# Altium schematic sheet 7_DDR3L.SchDoc: DDR3L Configuration
size Letter; Date: 12/28/2025; Author: Praveen Perera; DrawnBy: Praveen Perera; Engineer: Praveen Perera; Revision: 0; SheetNumber: 7; SheetTotal: 8
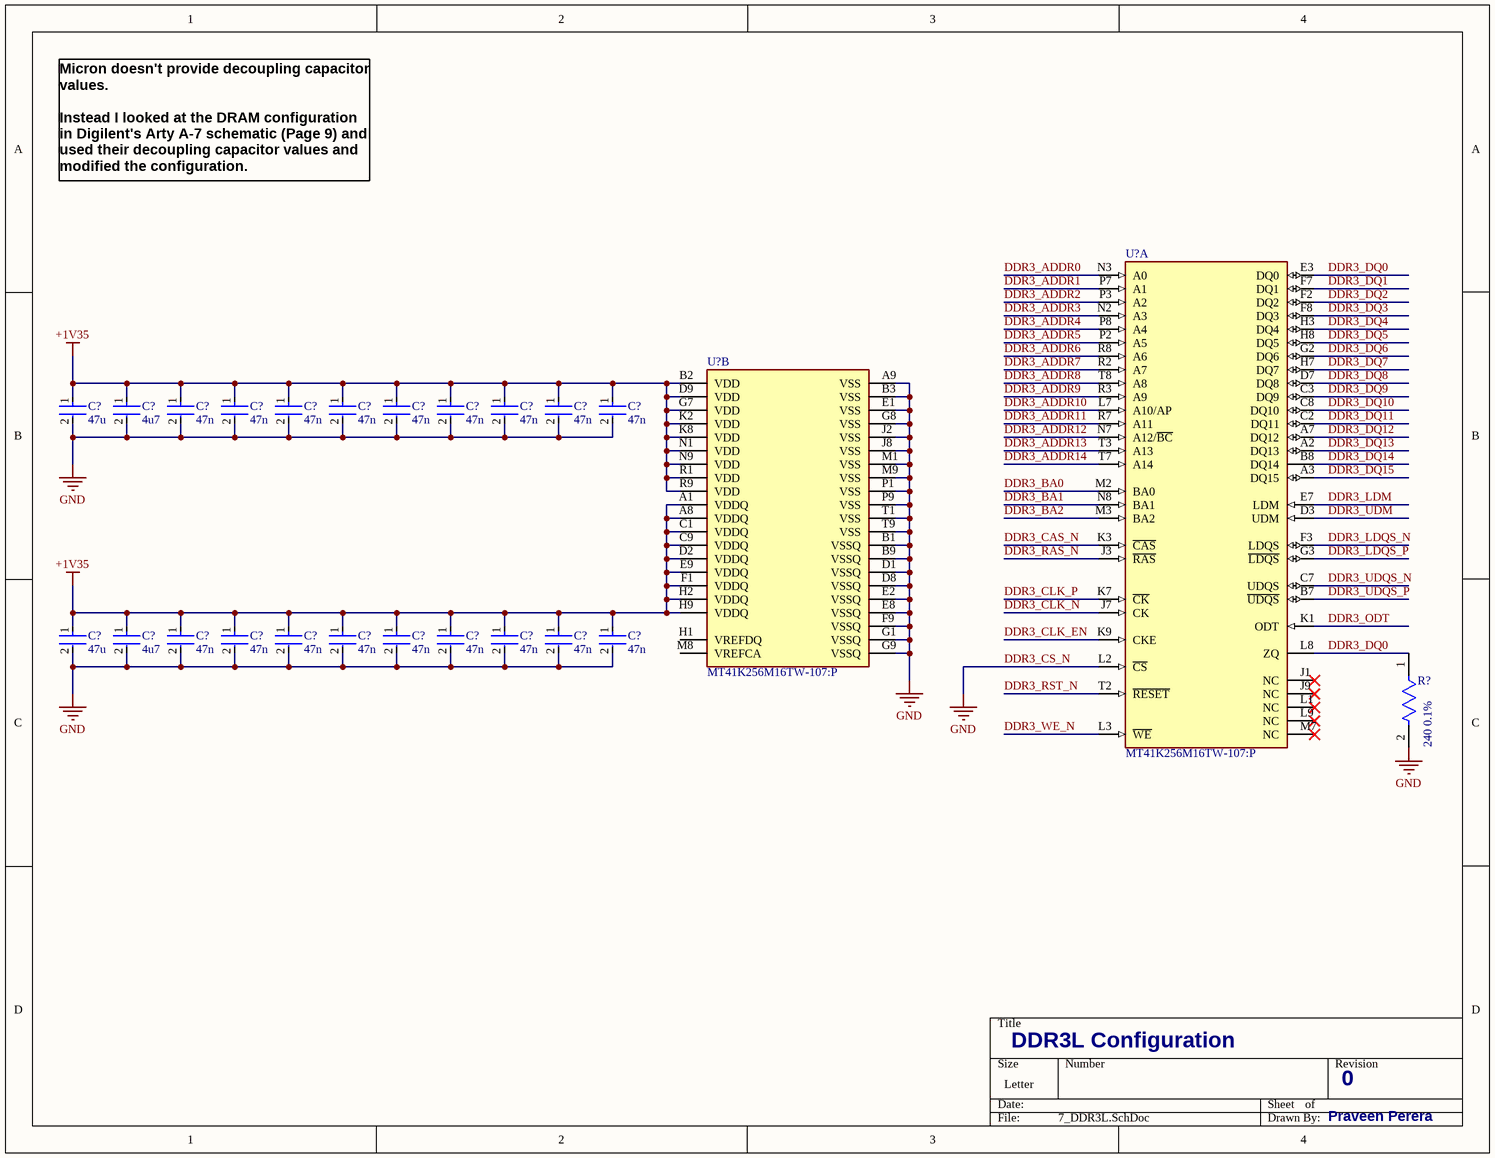
[diagram p0: 7_DDR3L.SchDoc]

## Parts
(Parts that share a designator on the sheet are numbered #1, #2 ... from top to bottom, then left to right.)
C?#1  47u  [FP-GRM188-0_2-IPC_B]
C?#2  4u7  [FP-CL829-IPC_C]
C?#3  47n  [FP-C0603-030-0_03-IPC_A]
C?#4  47n  [FP-C0603-030-0_03-IPC_A]
C?#5  47n  [FP-C0603-030-0_03-IPC_A]
C?#6  47n  [FP-C0603-030-0_03-IPC_A]
C?#7  47n  [FP-C0603-030-0_03-IPC_A]
C?#8  47n  [FP-C0603-030-0_03-IPC_A]
C?#9  47n  [FP-C0603-030-0_03-IPC_A]
C?#10  47n  [FP-C0603-030-0_03-IPC_A]
C?#11  47n  [FP-C0603-030-0_03-IPC_A]
C?#12  47u  [FP-GRM188-0_2-IPC_B]
C?#13  4u7  [FP-CL829-IPC_C]
C?#14  47n  [FP-C0603-030-0_03-IPC_A]
C?#15  47n  [FP-C0603-030-0_03-IPC_A]
C?#16  47n  [FP-C0603-030-0_03-IPC_A]
C?#17  47n  [FP-C0603-030-0_03-IPC_A]
C?#18  47n  [FP-C0603-030-0_03-IPC_A]
C?#19  47n  [FP-C0603-030-0_03-IPC_A]
C?#20  47n  [FP-C0603-030-0_03-IPC_A]
C?#21  47n  [FP-C0603-030-0_03-IPC_A]
C?#22  47n  [FP-C0603-030-0_03-IPC_A]
R?  240 0.1%  [FP-RT0201-MFG]
U?#1  MT41K256M16TW-107:P  [FP-TW-IPC_C]  (part A of 2)
U?#2  MT41K256M16TW-107:P  [FP-TW-IPC_C]  (part B of 2)

## Nets
+1V35: C?#1.1 C?#2.1 C?#3.1 C?#4.1 C?#5.1 C?#6.1 C?#7.1 C?#8.1 C?#9.1 C?#10.1 C?#11.1 C?#12.1 C?#13.1 C?#14.1 C?#15.1 C?#16.1 C?#17.1 C?#18.1 C?#19.1 C?#20.1 C?#21.1 C?#22.1 U?#2.A1(VDDQ) U?#2.A8(VDDQ) U?#2.B2(VDD) U?#2.C1(VDDQ) U?#2.C9(VDDQ) U?#2.D2(VDDQ) U?#2.D9(VDD) U?#2.E9(VDDQ) U?#2.F1(VDDQ) U?#2.G7(VDD) U?#2.H2(VDDQ) U?#2.H9(VDDQ) U?#2.K2(VDD) U?#2.K8(VDD) U?#2.N1(VDD) U?#2.N9(VDD) U?#2.R1(VDD) U?#2.R9(VDD)
DDR3_CS_N: C?#1.2 C?#2.2 C?#3.2 C?#4.2 C?#5.2 C?#6.2 C?#7.2 C?#8.2 C?#9.2 C?#10.2 C?#11.2 C?#12.2 C?#13.2 C?#14.2 C?#15.2 C?#16.2 C?#17.2 C?#18.2 C?#19.2 C?#20.2 C?#21.2 C?#22.2 R?.2 U?#1.L2(~{CS}) U?#2.A9(VSS) U?#2.B1(VSSQ) U?#2.B3(VSS) U?#2.B9(VSSQ) U?#2.D1(VSSQ) U?#2.D8(VSSQ) U?#2.E1(VSS) U?#2.E2(VSSQ) U?#2.E8(VSSQ) U?#2.F9(VSSQ) U?#2.G1(VSSQ) U?#2.G8(VSS) U?#2.G9(VSSQ) U?#2.J2(VSS) U?#2.J8(VSS) U?#2.M1(VSS) U?#2.M9(VSS) U?#2.P1(VSS) U?#2.P9(VSS) U?#2.T1(VSS) U?#2.T9(VSS)  [also labelled GND]
DDR3_ADDR0: U?#1.N3(A0)
DDR3_ADDR1: U?#1.P7(A1)
DDR3_ADDR2: U?#1.P3(A2)
DDR3_ADDR3: U?#1.N2(A3)
DDR3_ADDR4: U?#1.P8(A4)
DDR3_ADDR5: U?#1.P2(A5)
DDR3_ADDR6: U?#1.R8(A6)
DDR3_ADDR7: U?#1.R2(A7)
DDR3_ADDR8: U?#1.T8(A8)
DDR3_ADDR9: U?#1.R3(A9)
DDR3_ADDR10: U?#1.L7(A10/AP)
DDR3_ADDR11: U?#1.R7(A11)
DDR3_ADDR12: U?#1.N7(A12/~{BC})
DDR3_ADDR13: U?#1.T3(A13)
DDR3_ADDR14: U?#1.T7(A14)
DDR3_BA0: U?#1.M2(BA0)
DDR3_BA1: U?#1.N8(BA1)
DDR3_BA2: U?#1.M3(BA2)
DDR3_CAS_N: U?#1.K3(~{CAS})
DDR3_CLK_EN: U?#1.K9(CKE)
DDR3_CLK_N: U?#1.J7(CK)
DDR3_CLK_P: U?#1.K7(~{CK})
DDR3_DQ0: R?.1 U?#1.E3(DQ0) U?#1.L8(ZQ)
DDR3_DQ1: U?#1.F7(DQ1)
DDR3_DQ2: U?#1.F2(DQ2)
DDR3_DQ3: U?#1.F8(DQ3)
DDR3_DQ4: U?#1.H3(DQ4)
DDR3_DQ5: U?#1.H8(DQ5)
DDR3_DQ6: U?#1.G2(DQ6)
DDR3_DQ7: U?#1.H7(DQ7)
DDR3_DQ8: U?#1.D7(DQ8)
DDR3_DQ9: U?#1.C3(DQ9)
DDR3_DQ10: U?#1.C8(DQ10)
DDR3_DQ11: U?#1.C2(DQ11)
DDR3_DQ12: U?#1.A7(DQ12)
DDR3_DQ13: U?#1.A2(DQ13)
DDR3_DQ14: U?#1.B8(DQ14)
DDR3_DQ15: U?#1.A3(DQ15)
DDR3_LDM: U?#1.E7(LDM)
DDR3_LDQS_N: U?#1.F3(LDQS)
DDR3_LDQS_P: U?#1.G3(~{LDQS})
DDR3_ODT: U?#1.K1(ODT)
DDR3_RAS_N: U?#1.J3(~{RAS})
DDR3_RST_N: U?#1.T2(~{RESET})
DDR3_UDM: U?#1.D3(UDM)
DDR3_UDQS_N: U?#1.C7(UDQS)
DDR3_UDQS_P: U?#1.B7(~{UDQS})
DDR3_WE_N: U?#1.L3(~{WE})

Not connected (* = marked no-connect by the designer): U?#1 J1(NC)* J9(NC)* L1(NC)* L9(NC)* M7(NC)*; U?#2 H1(VREFDQ) M8(VREFCA)

## Notes on the sheet
- Micron doesn't provide decoupling capacitor values.
  Instead I looked at the DRAM configuration in Digilent's Arty A-7 schematic (Page 9) and used their decoupling capacitor values and modified the configuration.

## Library data of the parts
C?#1 C?#12 = CMP-2000-05444-2: GRM188R60J476ME15D / Chip Multilayer Ceramic Capacitors for General Purpose, 0603, 47uF, X5R, 15%, 20%, 6.3V; Voltage Rating (DC): 6.3V; Thickness: 0.039inch; Case Code (Imperial): 0603; Packaging: Tape and Reel; Capacitance: 47uF; Width: 0.031inch; Dielectric: X5R; Max Operating Temperature: 85°C; Mount: Surface Mount; Case Code (Metric): 1608; Length: 0.063inch; Voltage Rating: 6.3V; Tolerance: 20%; Case/Package: 0603; Min Operating Temperature: -55°C
C?#2 C?#13 = CMP-13271-001468-1: CL05A475MO5NUNC / Cap Ceramic 4.7uF 16V X5R ±20% SMD 0402 +85°C Paper T/R; Mount: Surface Mount; Case Code (Metric): 1005; Case/Package: 0402; Length: 0.039inch; Capacitance: 4.7uF; Voltage Rating: 16V; Max Operating Temperature: 85°C; Tolerance: 20%; Thickness: 0.022inch; Min Operating Temperature: -55°C; Case Code (Imperial): 0402; Packaging: Tape and Reel; Width: 0.02inch
C?#3-C?#11 C?#14-C?#22 = CMP-08246-004548-1: C0603X5R1E473K030BB / Multilayer Ceramic Capacitors 47nF ±10% 25V X5R SMD 0201; Min Operating Temperature: -55°C; Case Code (Imperial): 0201; Termination: SMD/SMT; Voltage Rating (DC): 25V; Max Operating Temperature: 85°C; Case Code (Metric): 0603; Dielectric: X5R; Voltage Rating: 25V; RoHS Compliant: Yes; Thickness: 0.013inch; Length: 0.024inch; Dielectric Material: Ceramic; Width: 0.3mm; Capacitance: 47nF; Case/Package: 0201; Series: C; Tolerance: 10%; Packaging: Tape and Reel; Weight: 6E-06oz; Height: 0.3mm; Package Quantity: 15000; Mount: Surface Mount; Lead Free: Lead Free
R? = CMP-03412-015201-1: RT0201BRD07240RL / RT0201 240Ω 0.05W 25 ppm/°C 0.10%; Manufacturer: Yageo; Tolerance: 0.001; Voltage Rating: 25V; Temperature Coefficient: 25 ppm/°C; Description: RT0201 240Ω 0.05W 25 ppm/°C 0.10%; RoHS: TRUE; Temperature Range High: +125°C; Footprint Url: http://www.yageo.com/exep/pages/download/literatures/PYu-R_Mount_10.pdf; Octopart: https://octopart.com/rt0201brd07240rl-yageo-87214234; Device Class L1: Passive Components; Manufacturer Part Number: RT0201BRD07240RL; Device Class L3: Chip SMD Resistors; Series: RT; Automotive: No; Ipc Land Pattern Name: RESC6030X23; Composition: Thin Film; Value: 240Ω; Power Rating: 0.05W; Temperature Range Low: -55°C; Category: Res; Lead Free: Yes; Resistance: 240Ω; Temperature: -55°C to +125°C; Device Class L2: Resistors; ComponentLink2URL: http://www.yageo.com/documents/recent/PYu-RT_1-to-0.01_RoHS_L_9.pdf; ComponentLink2Description: Datasheet; Package: RT0201; Height: 0.26mm
U?#1 = CMP-2000-07475-2: IC DRAM 4G PARALLEL 96FBGA; Manufacturer: Micron; Access Time: 1.07ns; Nominal Supply Current: 12-156mA; Min Supply Voltage: 1.283V; Memory Type: SDRAM,DDR3; Standoff Height: 0.29mm; Max Supply Voltage: 1.45V; Memory Size: 4Gbits; Device Class L1: Integrated Circuits (ICs); Lead Free: Yes; ComponentLink2Description: Datasheet; Manufacturer Part Number: MT41K256M16TW-107:P; Category: IC; Digikey Description: IC DRAM 4G PARALLEL 96FBGA; Device Class L3: RAM; Interface: Parallel; RoHS: TRUE; Octopart: https://octopart.com/mt41k256m16tw-107%3Ap-micron-66533852; Temperature Range High: +85°C; ComponentLink2URL: https://www.micron.com/-/media/client/global/documents/products/data-sheet/dram/ddr3/4gb_ddr3l.pdf; Temperature: 0°C to +85°C; Package: TW; Device Class L2: Memory; Automotive: No; Height: 1.2mm; Temperature Range Low: 0°C
U?#2 = CMP-2000-07475-2: IC DRAM 4G PARALLEL 96FBGA; Manufacturer: Micron; Access Time: 1.07ns; Nominal Supply Current: 12-156mA; Description: DRAM Chip DDR3L SDRAM 4G-Bit 256Mx16 1.35V 96-Pin F-BGA; Min Supply Voltage: 1.283V; Memory Type: SDRAM,DDR3; Standoff Height: 0.29mm; Max Supply Voltage: 1.45V; Memory Size: 4Gbits; Device Class L1: Integrated Circuits (ICs); Lead Free: Yes; ComponentLink2Description: Datasheet; Manufacturer Part Number: MT41K256M16TW-107:P; Category: IC; Digikey Description: IC DRAM 4G PARALLEL 96FBGA; Device Class L3: RAM; Interface: Parallel; RoHS: TRUE; Octopart: https://octopart.com/mt41k256m16tw-107%3Ap-micron-66533852; Temperature Range High: +85°C; ComponentLink2URL: https://www.micron.com/-/media/client/global/documents/products/data-sheet/dram/ddr3/4gb_ddr3l.pdf; Temperature: 0°C to +85°C; Package: TW; Device Class L2: Memory; Automotive: No; Height: 1.2mm; Temperature Range Low: 0°C